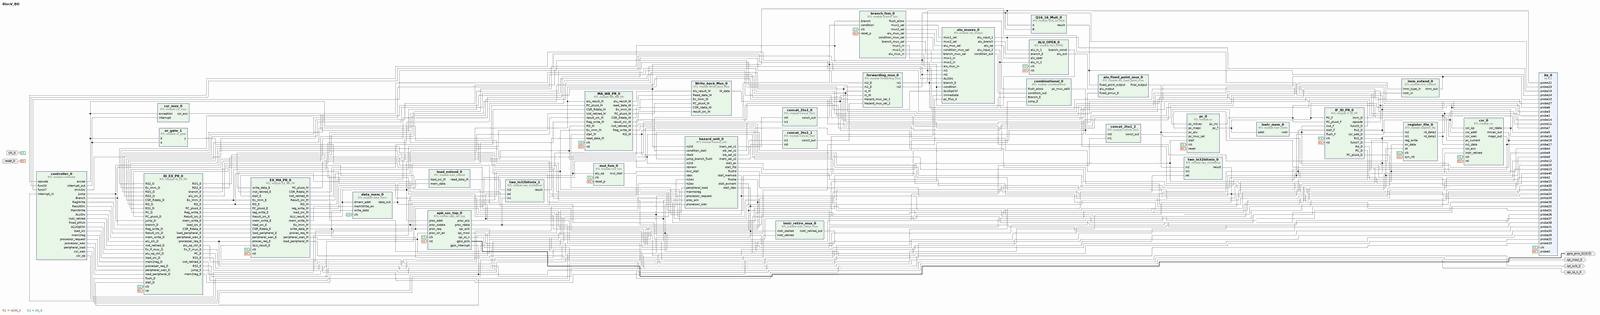
[diagram p0: block diagram of the top level, whole]
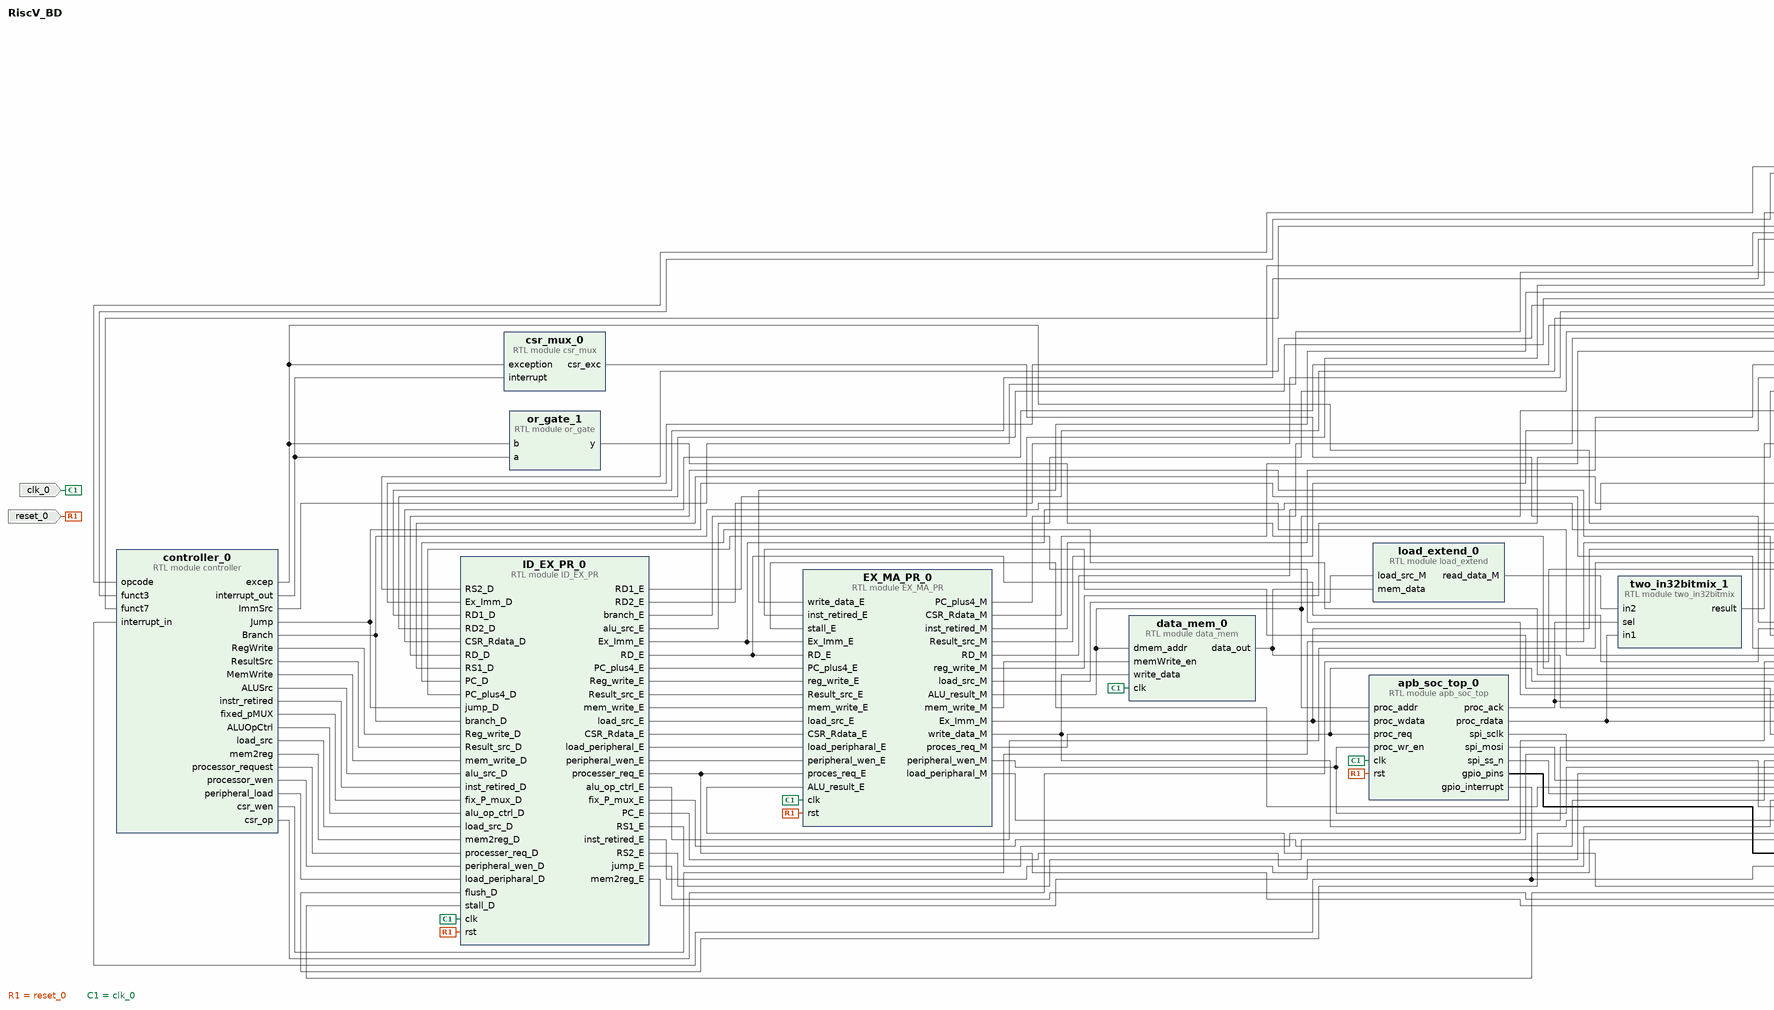
[diagram p1: block diagram of the top level, left part]
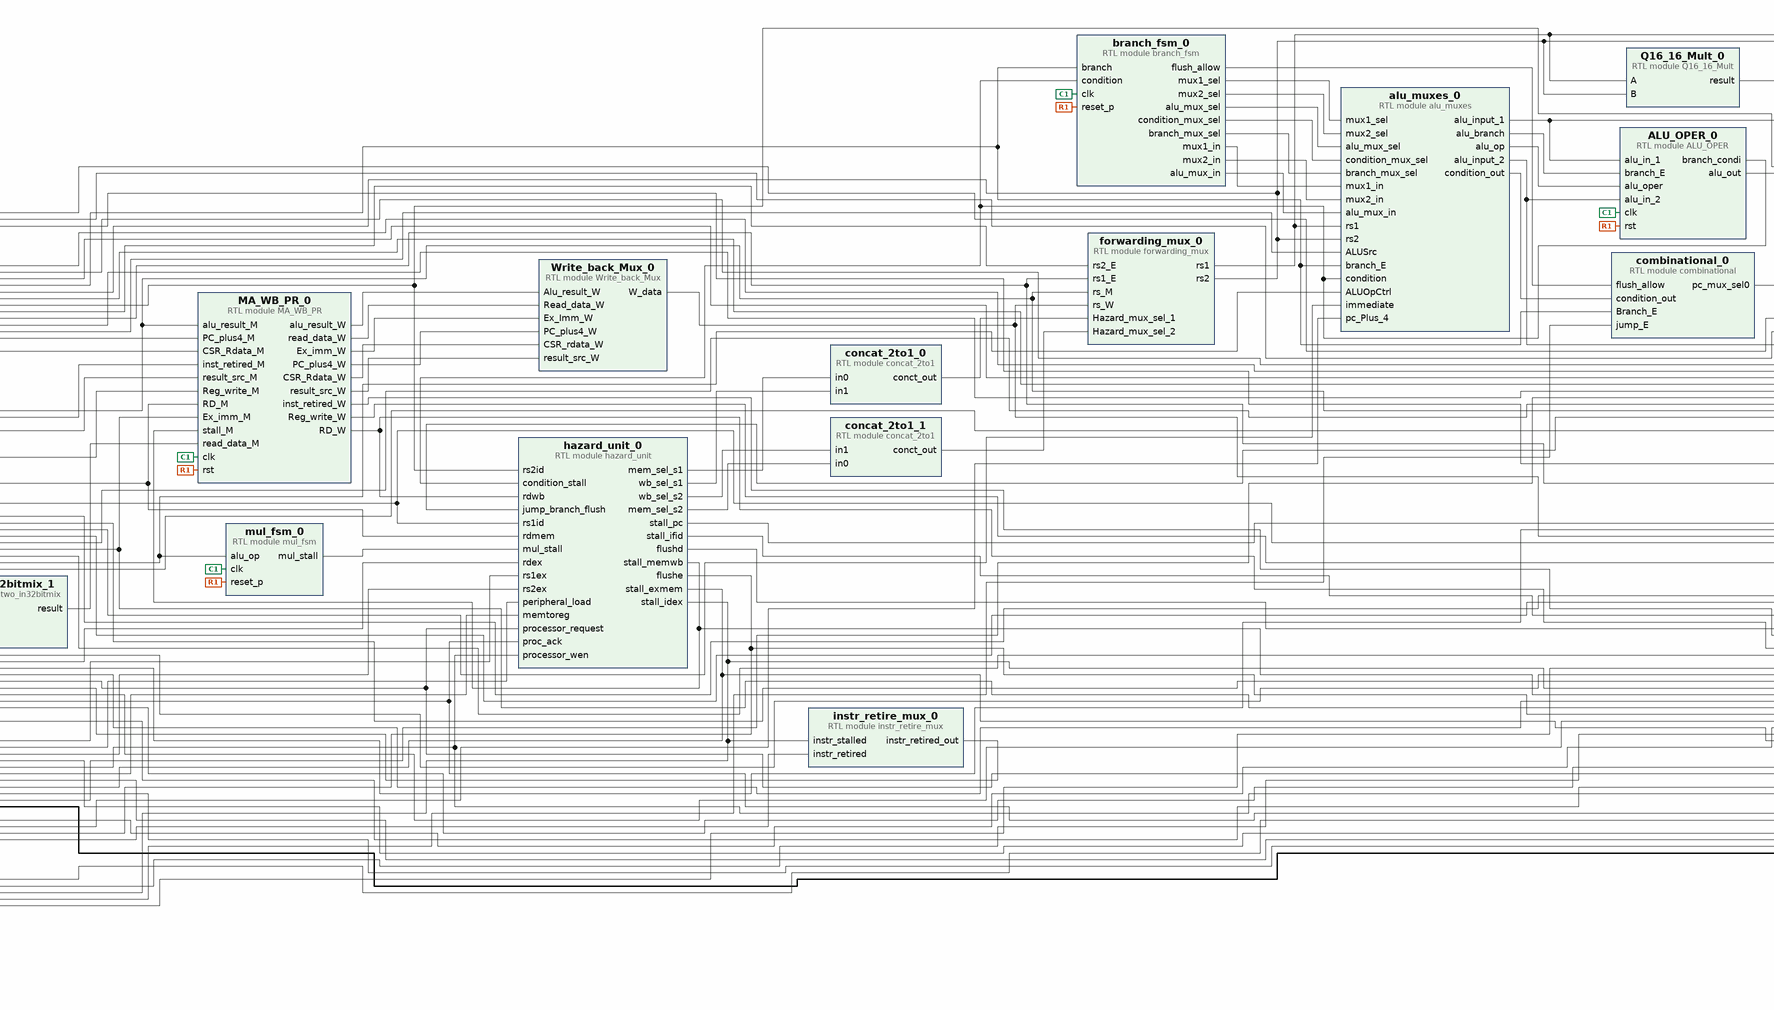
[diagram p2: block diagram of the top level, centre part]
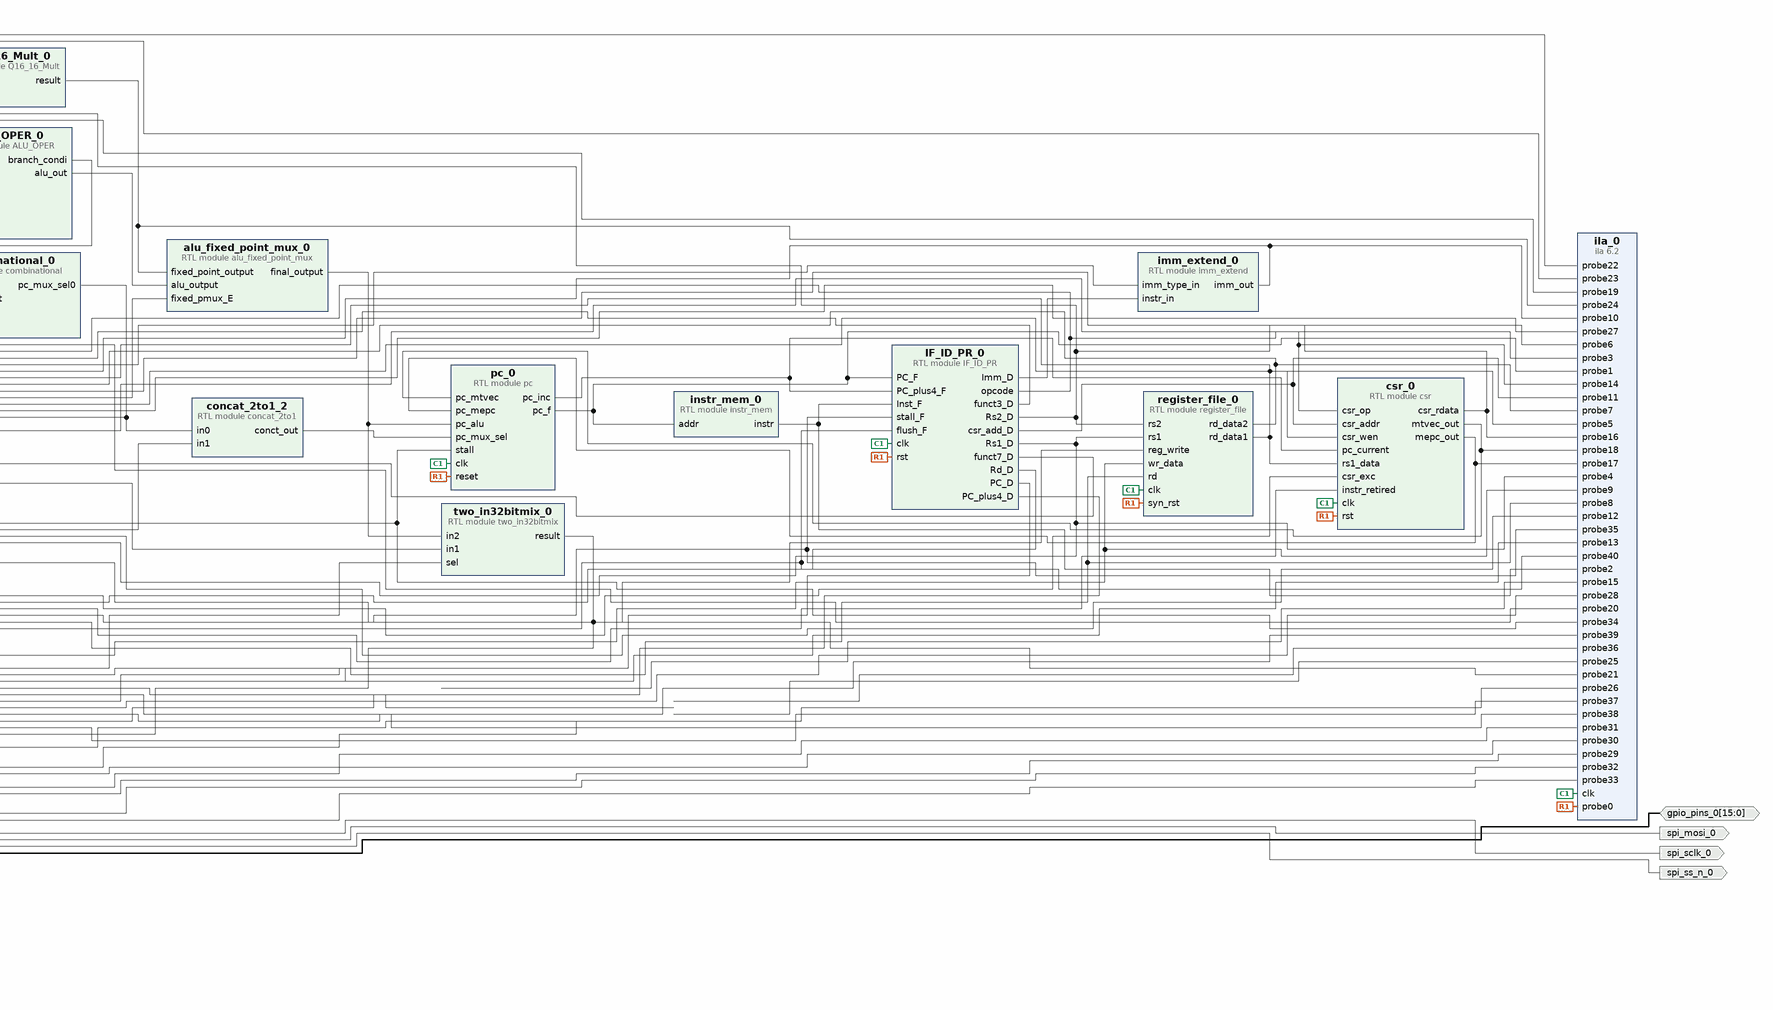
[diagram p3: block diagram of the top level, right part]
# Vivado block design RiscV_BD, xc7z020clg400-1, Vivado 2020.2
create_bd_design RiscV_BD

create_bd_port -dir I -type rst reset_0
create_bd_port -dir I -type clk clk_0
create_bd_port -dir O spi_sclk_0
create_bd_port -dir O spi_mosi_0
create_bd_port -dir O spi_ss_n_0
create_bd_port -dir IO -from 15 -to 0 gpio_pins_0

create_bd_cell -type module -reference register_file register_file_0
create_bd_cell -type module -reference csr csr_0
create_bd_cell -type module -reference alu_fixed_point_mux alu_fixed_point_mux_0
create_bd_cell -type module -reference csr_mux csr_mux_0
create_bd_cell -type module -reference forwarding_mux forwarding_mux_0
create_bd_cell -type module -reference load_extend load_extend_0
create_bd_cell -type module -reference Write_back_Mux Write_back_Mux_0
create_bd_cell -type module -reference combinational combinational_0
create_bd_cell -type module -reference instr_retire_mux instr_retire_mux_0
create_bd_cell -type module -reference concat_2to1 concat_2to1_0
create_bd_cell -type module -reference concat_2to1 concat_2to1_1
create_bd_cell -type module -reference concat_2to1 concat_2to1_2
create_bd_cell -type module -reference or_gate or_gate_1
create_bd_cell -type module -reference alu_muxes alu_muxes_0
create_bd_cell -type module -reference pc pc_0
create_bd_cell -type module -reference mul_fsm mul_fsm_0
create_bd_cell -type module -reference IF_ID_PR IF_ID_PR_0
create_bd_cell -type module -reference MA_WB_PR MA_WB_PR_0
create_bd_cell -type module -reference imm_extend imm_extend_0
create_bd_cell -type module -reference hazard_unit hazard_unit_0
create_bd_cell -type module -reference two_in32bitmix two_in32bitmix_0
create_bd_cell -type module -reference two_in32bitmix two_in32bitmix_1
create_bd_cell -type module -reference ID_EX_PR ID_EX_PR_0
create_bd_cell -type module -reference EX_MA_PR EX_MA_PR_0
create_bd_cell -type ip -vlnv xilinx.com:ip:ila:6.2 ila_0
set_property -dict [list \
  CONFIG.C_ENABLE_ILA_AXI_MON false \
  CONFIG.C_MONITOR_TYPE Native \
  CONFIG.C_NUM_OF_PROBES 41 \
  CONFIG.C_PROBE10_WIDTH 32 \
  CONFIG.C_PROBE11_WIDTH 12 \
  CONFIG.C_PROBE12_WIDTH 1 \
  CONFIG.C_PROBE14_WIDTH 2 \
  CONFIG.C_PROBE15_WIDTH 1 \
  CONFIG.C_PROBE16_WIDTH 32 \
  CONFIG.C_PROBE17_WIDTH 32 \
  CONFIG.C_PROBE18_WIDTH 32 \
  CONFIG.C_PROBE19_WIDTH 32 \
  CONFIG.C_PROBE1_WIDTH 32 \
  CONFIG.C_PROBE20_WIDTH 32 \
  CONFIG.C_PROBE21_WIDTH 32 \
  CONFIG.C_PROBE22_WIDTH 32 \
  CONFIG.C_PROBE23_WIDTH 32 \
  CONFIG.C_PROBE24_WIDTH 32 \
  CONFIG.C_PROBE25_WIDTH 32 \
  CONFIG.C_PROBE26_WIDTH 32 \
  CONFIG.C_PROBE27_WIDTH 32 \
  CONFIG.C_PROBE28_WIDTH 32 \
  CONFIG.C_PROBE2_WIDTH 32 \
  CONFIG.C_PROBE31_WIDTH 32 \
  CONFIG.C_PROBE34_WIDTH 1 \
  CONFIG.C_PROBE3_WIDTH 7 \
  CONFIG.C_PROBE4_WIDTH 5 \
  CONFIG.C_PROBE5_WIDTH 32 \
  CONFIG.C_PROBE6_WIDTH 5 \
  CONFIG.C_PROBE7_WIDTH 32 \
  CONFIG.C_PROBE8_WIDTH 5 \
  CONFIG.C_PROBE9_WIDTH 32 \
] [get_bd_cells ila_0]
create_bd_cell -type module -reference apb_soc_top apb_soc_top_0
create_bd_cell -type module -reference Q16_16_Mult Q16_16_Mult_0
create_bd_cell -type module -reference ALU_OPER ALU_OPER_0
create_bd_cell -type module -reference branch_fsm branch_fsm_0
create_bd_cell -type module -reference controller controller_0
create_bd_cell -type module -reference instr_mem instr_mem_0
create_bd_cell -type module -reference data_mem data_mem_0

# ---- connections ----

connect_bd_net [get_bd_pins IF_ID_PR_0/Rs2_D] \
  [get_bd_pins register_file_0/rs2] [get_bd_pins hazard_unit_0/rs2id] [get_bd_pins ID_EX_PR_0/RS2_D] \
  [get_bd_pins ila_0/probe6]
connect_bd_net [get_bd_pins IF_ID_PR_0/opcode] [get_bd_pins ila_0/probe3] [get_bd_pins controller_0/opcode]
connect_bd_net [get_bd_pins IF_ID_PR_0/funct3_D] [get_bd_pins controller_0/funct3]
connect_bd_net [get_bd_pins IF_ID_PR_0/funct7_D] [get_bd_pins controller_0/funct7]
connect_bd_net [get_bd_pins IF_ID_PR_0/Imm_D] [get_bd_pins imm_extend_0/instr_in]
connect_bd_net [get_bd_pins controller_0/ImmSrc] [get_bd_pins imm_extend_0/imm_type_in]
connect_bd_net [get_bd_pins imm_extend_0/imm_out] [get_bd_pins ID_EX_PR_0/Ex_Imm_D] [get_bd_pins ila_0/probe10]
connect_bd_net [get_bd_pins IF_ID_PR_0/csr_add_D] [get_bd_pins csr_0/csr_addr] [get_bd_pins ila_0/probe11]
connect_bd_net [get_bd_pins register_file_0/rd_data1] [get_bd_pins csr_0/rs1_data] [get_bd_pins ID_EX_PR_0/RD1_D] [get_bd_pins ila_0/probe5]
connect_bd_net [get_bd_pins register_file_0/rd_data2] [get_bd_pins ID_EX_PR_0/RD2_D] [get_bd_pins ila_0/probe7]
connect_bd_net [get_bd_pins csr_0/csr_rdata] [get_bd_pins ID_EX_PR_0/CSR_Rdata_D] [get_bd_pins ila_0/probe16]
connect_bd_net [get_bd_pins controller_0/csr_wen] [get_bd_pins csr_0/csr_wen]
connect_bd_net [get_bd_pins controller_0/csr_op] [get_bd_pins csr_0/csr_op] [get_bd_pins ila_0/probe14]
connect_bd_net [get_bd_pins ID_EX_PR_0/RD1_E] [get_bd_pins forwarding_mux_0/rs1_E] [get_bd_pins two_in32bitmix_0/in1]
connect_bd_net [get_bd_pins ID_EX_PR_0/RD2_E] [get_bd_pins forwarding_mux_0/rs2_E]
connect_bd_net [get_bd_pins forwarding_mux_0/rs1] [get_bd_pins alu_muxes_0/rs1] [get_bd_pins ila_0/probe22] [get_bd_pins Q16_16_Mult_0/A]
connect_bd_net [get_bd_pins forwarding_mux_0/rs2] \
  [get_bd_pins alu_muxes_0/rs2] [get_bd_pins EX_MA_PR_0/write_data_E] [get_bd_pins ila_0/probe23] \
  [get_bd_pins Q16_16_Mult_0/B]
connect_bd_net [get_bd_pins branch_fsm_0/mux1_sel] [get_bd_pins alu_muxes_0/mux1_sel]
connect_bd_net [get_bd_pins branch_fsm_0/mux2_sel] [get_bd_pins alu_muxes_0/mux2_sel]
connect_bd_net [get_bd_pins branch_fsm_0/alu_mux_sel] [get_bd_pins alu_muxes_0/alu_mux_sel]
connect_bd_net [get_bd_pins branch_fsm_0/condition_mux_sel] [get_bd_pins alu_muxes_0/condition_mux_sel]
connect_bd_net [get_bd_pins branch_fsm_0/branch_mux_sel] [get_bd_pins alu_muxes_0/branch_mux_sel]
connect_bd_net [get_bd_pins branch_fsm_0/mux1_in] [get_bd_pins alu_muxes_0/mux1_in]
connect_bd_net [get_bd_pins branch_fsm_0/mux2_in] [get_bd_pins alu_muxes_0/mux2_in]
connect_bd_net [get_bd_pins branch_fsm_0/alu_mux_in] [get_bd_pins alu_muxes_0/alu_mux_in]
connect_bd_net [get_bd_pins ALU_OPER_0/branch_condi] \
  [get_bd_pins alu_muxes_0/condition] [get_bd_pins hazard_unit_0/condition_stall] [get_bd_pins branch_fsm_0/condition]
connect_bd_net [get_bd_pins alu_muxes_0/alu_branch] [get_bd_pins ALU_OPER_0/branch_E]
connect_bd_net [get_bd_pins alu_muxes_0/alu_input_1] [get_bd_pins ila_0/probe19] [get_bd_pins ALU_OPER_0/alu_in_1]
connect_bd_net [get_bd_pins alu_muxes_0/alu_op] [get_bd_pins ALU_OPER_0/alu_oper]
connect_bd_net [get_bd_pins ID_EX_PR_0/branch_E] \
  [get_bd_pins combinational_0/Branch_E] [get_bd_pins alu_muxes_0/branch_E] [get_bd_pins branch_fsm_0/branch]
connect_bd_net [get_bd_pins ID_EX_PR_0/alu_src_E] [get_bd_pins alu_muxes_0/ALUSrc]
connect_bd_net [get_bd_pins ID_EX_PR_0/alu_op_ctrl_E] [get_bd_pins alu_muxes_0/ALUOpCtrl] [get_bd_pins mul_fsm_0/alu_op]
connect_bd_net [get_bd_pins ID_EX_PR_0/PC_plus4_E] [get_bd_pins EX_MA_PR_0/PC_plus4_E]
connect_bd_net [get_bd_pins ID_EX_PR_0/Ex_Imm_E] [get_bd_pins alu_muxes_0/immediate] [get_bd_pins EX_MA_PR_0/Ex_Imm_E]
connect_bd_net [get_bd_pins ALU_OPER_0/alu_out] [get_bd_pins alu_fixed_point_mux_0/alu_output]
connect_bd_net [get_bd_pins Q16_16_Mult_0/result] [get_bd_pins alu_fixed_point_mux_0/fixed_point_output] [get_bd_pins ila_0/probe24]
connect_bd_net [get_bd_pins alu_fixed_point_mux_0/final_output] [get_bd_pins pc_0/pc_alu] [get_bd_pins two_in32bitmix_0/in2]
connect_bd_net [get_bd_pins ID_EX_PR_0/fix_P_mux_E] [get_bd_pins alu_fixed_point_mux_0/fixed_pmux_E]
connect_bd_net [get_bd_pins EX_MA_PR_0/ALU_result_M] \
  [get_bd_pins forwarding_mux_0/rs_M] [get_bd_pins MA_WB_PR_0/alu_result_M] [get_bd_pins ila_0/probe27] \
  [get_bd_pins apb_soc_top_0/proc_addr] [get_bd_pins data_mem_0/dmem_addr]
connect_bd_net [get_bd_pins csr_mux_0/csr_exc] [get_bd_pins csr_0/csr_exc]
connect_bd_net [get_bd_pins IF_ID_PR_0/Rd_D] [get_bd_pins ID_EX_PR_0/RD_D]
connect_bd_net [get_bd_pins controller_0/RegWrite] [get_bd_pins ID_EX_PR_0/Reg_write_D]
connect_bd_net [get_bd_pins controller_0/ResultSrc] [get_bd_pins ID_EX_PR_0/Result_src_D]
connect_bd_net [get_bd_pins controller_0/MemWrite] [get_bd_pins ID_EX_PR_0/mem_write_D]
connect_bd_net [get_bd_pins controller_0/Jump] [get_bd_pins ID_EX_PR_0/jump_D] [get_bd_pins ila_0/probe12]
connect_bd_net [get_bd_pins controller_0/Branch] [get_bd_pins ID_EX_PR_0/branch_D] [get_bd_pins ila_0/probe13]
connect_bd_net [get_bd_pins controller_0/ALUSrc] [get_bd_pins ID_EX_PR_0/alu_src_D]
connect_bd_net [get_bd_pins controller_0/instr_retired] [get_bd_pins ID_EX_PR_0/inst_retired_D]
connect_bd_net [get_bd_pins controller_0/fixed_pMUX] [get_bd_pins ID_EX_PR_0/fix_P_mux_D]
connect_bd_net [get_bd_pins controller_0/excep] [get_bd_pins csr_mux_0/exception] [get_bd_pins or_gate_1/b] [get_bd_pins ila_0/probe15]
connect_bd_net [get_bd_pins IF_ID_PR_0/Rs1_D] \
  [get_bd_pins register_file_0/rs1] [get_bd_pins hazard_unit_0/rs1id] [get_bd_pins ID_EX_PR_0/RS1_D] \
  [get_bd_pins ila_0/probe4]
connect_bd_net [get_bd_pins IF_ID_PR_0/PC_D] [get_bd_pins ID_EX_PR_0/PC_D]
connect_bd_net [get_bd_pins IF_ID_PR_0/PC_plus4_D] [get_bd_pins ID_EX_PR_0/PC_plus4_D]
connect_bd_net [get_bd_pins ID_EX_PR_0/Reg_write_E] [get_bd_pins EX_MA_PR_0/reg_write_E]
connect_bd_net [get_bd_pins ID_EX_PR_0/Result_src_E] [get_bd_pins EX_MA_PR_0/Result_src_E]
connect_bd_net [get_bd_pins ID_EX_PR_0/mem_write_E] [get_bd_pins EX_MA_PR_0/mem_write_E]
connect_bd_net [get_bd_pins ID_EX_PR_0/load_src_E] [get_bd_pins EX_MA_PR_0/load_src_E]
connect_bd_net [get_bd_pins ID_EX_PR_0/RD_E] [get_bd_pins hazard_unit_0/rdex] [get_bd_pins EX_MA_PR_0/RD_E]
connect_bd_net [get_bd_pins ID_EX_PR_0/CSR_Rdata_E] [get_bd_pins EX_MA_PR_0/CSR_Rdata_E]
connect_bd_net [get_bd_pins EX_MA_PR_0/PC_plus4_M] [get_bd_pins MA_WB_PR_0/PC_plus4_M]
connect_bd_net [get_bd_pins EX_MA_PR_0/CSR_Rdata_M] [get_bd_pins MA_WB_PR_0/CSR_Rdata_M]
connect_bd_net [get_bd_pins EX_MA_PR_0/Ex_Imm_M] [get_bd_pins MA_WB_PR_0/Ex_imm_M] [get_bd_pins ila_0/probe28] [get_bd_pins apb_soc_top_0/proc_wdata]
connect_bd_net [get_bd_pins EX_MA_PR_0/RD_M] [get_bd_pins MA_WB_PR_0/RD_M] [get_bd_pins hazard_unit_0/rdmem]
connect_bd_net [get_bd_pins EX_MA_PR_0/load_src_M] [get_bd_pins load_extend_0/load_src_M]
connect_bd_net [get_bd_pins EX_MA_PR_0/inst_retired_M] [get_bd_pins MA_WB_PR_0/inst_retired_M]
connect_bd_net [get_bd_pins EX_MA_PR_0/Result_src_M] [get_bd_pins MA_WB_PR_0/result_src_M]
connect_bd_net [get_bd_pins EX_MA_PR_0/reg_write_M] [get_bd_pins MA_WB_PR_0/Reg_write_M]
connect_bd_net [get_bd_pins MA_WB_PR_0/alu_result_W] [get_bd_pins Write_back_Mux_0/Alu_result_W]
connect_bd_net [get_bd_pins MA_WB_PR_0/read_data_W] [get_bd_pins Write_back_Mux_0/Read_data_W]
connect_bd_net [get_bd_pins MA_WB_PR_0/Ex_imm_W] [get_bd_pins Write_back_Mux_0/Ex_Imm_W]
connect_bd_net [get_bd_pins MA_WB_PR_0/PC_plus4_W] [get_bd_pins Write_back_Mux_0/PC_plus4_W]
connect_bd_net [get_bd_pins MA_WB_PR_0/CSR_Rdata_W] [get_bd_pins Write_back_Mux_0/CSR_rdata_W]
connect_bd_net [get_bd_pins MA_WB_PR_0/result_src_W] [get_bd_pins Write_back_Mux_0/result_src_W]
connect_bd_net [get_bd_pins MA_WB_PR_0/inst_retired_W] [get_bd_pins csr_0/instr_retired]
connect_bd_net [get_bd_pins MA_WB_PR_0/Reg_write_W] [get_bd_pins register_file_0/reg_write]
connect_bd_net [get_bd_pins csr_0/mtvec_out] [get_bd_pins pc_0/pc_mtvec] [get_bd_pins ila_0/probe18]
connect_bd_net [get_bd_pins pc_0/pc_f] [get_bd_pins IF_ID_PR_0/PC_F] [get_bd_pins ila_0/probe1] [get_bd_pins instr_mem_0/addr]
connect_bd_net [get_bd_pins pc_0/pc_inc] [get_bd_pins csr_0/pc_current] [get_bd_pins IF_ID_PR_0/PC_plus4_F]
connect_bd_net [get_bd_pins alu_muxes_0/alu_input_2] [get_bd_pins ila_0/probe20] [get_bd_pins ALU_OPER_0/alu_in_2]
connect_bd_net [get_bd_pins ID_EX_PR_0/PC_E] [get_bd_pins alu_muxes_0/pc_Plus_4]
connect_bd_net [get_bd_pins ID_EX_PR_0/inst_retired_E] [get_bd_pins instr_retire_mux_0/instr_retired]
connect_bd_net [get_bd_pins instr_retire_mux_0/instr_retired_out] [get_bd_pins EX_MA_PR_0/inst_retired_E]
connect_bd_net [get_bd_pins branch_fsm_0/flush_allow] [get_bd_pins combinational_0/flush_allow]
connect_bd_net [get_bd_pins ID_EX_PR_0/jump_E] [get_bd_pins combinational_0/jump_E]
connect_bd_net [get_bd_pins alu_muxes_0/condition_out] [get_bd_pins combinational_0/condition_out]
connect_bd_net [get_bd_pins Write_back_Mux_0/W_data] \
  [get_bd_pins register_file_0/wr_data] [get_bd_pins forwarding_mux_0/rs_W] [get_bd_pins ila_0/probe9]
connect_bd_net [get_bd_pins MA_WB_PR_0/RD_W] [get_bd_pins register_file_0/rd] [get_bd_pins hazard_unit_0/rdwb] [get_bd_pins ila_0/probe8]
connect_bd_net [get_bd_pins mul_fsm_0/mul_stall] [get_bd_pins hazard_unit_0/mul_stall]
connect_bd_net [get_bd_pins ID_EX_PR_0/RS1_E] [get_bd_pins hazard_unit_0/rs1ex]
connect_bd_net [get_bd_pins ID_EX_PR_0/RS2_E] [get_bd_pins hazard_unit_0/rs2ex]
connect_bd_net [get_bd_pins combinational_0/pc_mux_sel0] [get_bd_pins concat_2to1_2/in0] [get_bd_pins hazard_unit_0/jump_branch_flush]
connect_bd_net [get_bd_pins hazard_unit_0/stall_ifid] [get_bd_pins IF_ID_PR_0/stall_F] [get_bd_pins ila_0/probe35]
connect_bd_net [get_bd_pins csr_0/mepc_out] [get_bd_pins pc_0/pc_mepc] [get_bd_pins ila_0/probe17]
connect_bd_net [get_bd_pins hazard_unit_0/mem_sel_s1] [get_bd_pins concat_2to1_0/in0]
connect_bd_net [get_bd_pins hazard_unit_0/wb_sel_s2] [get_bd_pins concat_2to1_1/in1]
connect_bd_net [get_bd_pins hazard_unit_0/wb_sel_s1] [get_bd_pins concat_2to1_0/in1]
connect_bd_net [get_bd_pins hazard_unit_0/mem_sel_s2] [get_bd_pins concat_2to1_1/in0]
connect_bd_net [get_bd_pins concat_2to1_0/conct_out] [get_bd_pins forwarding_mux_0/Hazard_mux_sel_1]
connect_bd_net [get_bd_pins concat_2to1_1/conct_out] [get_bd_pins forwarding_mux_0/Hazard_mux_sel_2]
connect_bd_net [get_bd_pins hazard_unit_0/stall_pc] [get_bd_pins pc_0/stall] [get_bd_pins ila_0/probe34]
connect_bd_net [get_bd_pins hazard_unit_0/flushd] [get_bd_pins IF_ID_PR_0/flush_F] [get_bd_pins ila_0/probe40]
connect_bd_net [get_bd_pins hazard_unit_0/flushe] [get_bd_pins ID_EX_PR_0/flush_D] [get_bd_pins ila_0/probe39]
connect_bd_net [get_bd_pins hazard_unit_0/stall_idex] \
  [get_bd_pins instr_retire_mux_0/instr_stalled] [get_bd_pins ID_EX_PR_0/stall_D] [get_bd_pins ila_0/probe36]
connect_bd_net [get_bd_pins concat_2to1_2/conct_out] [get_bd_pins pc_0/pc_mux_sel]
connect_bd_net -net interrupt_0_1 [get_bd_pins controller_0/interrupt_out] [get_bd_pins csr_mux_0/interrupt] [get_bd_pins or_gate_1/a]
connect_bd_net -net reset_0_1 [get_bd_ports reset_0] \
  [get_bd_pins register_file_0/syn_rst] [get_bd_pins csr_0/rst] [get_bd_pins pc_0/reset] [get_bd_pins mul_fsm_0/reset_p] \
  [get_bd_pins IF_ID_PR_0/rst] [get_bd_pins MA_WB_PR_0/rst] [get_bd_pins ID_EX_PR_0/rst] [get_bd_pins EX_MA_PR_0/rst] \
  [get_bd_pins ila_0/probe0] [get_bd_pins apb_soc_top_0/rst] [get_bd_pins ALU_OPER_0/rst] [get_bd_pins branch_fsm_0/reset_p]
connect_bd_net -net clk_0_1 [get_bd_ports clk_0] \
  [get_bd_pins csr_0/clk] [get_bd_pins register_file_0/clk] [get_bd_pins pc_0/clk] [get_bd_pins mul_fsm_0/clk] \
  [get_bd_pins IF_ID_PR_0/clk] [get_bd_pins MA_WB_PR_0/clk] [get_bd_pins ID_EX_PR_0/clk] [get_bd_pins EX_MA_PR_0/clk] \
  [get_bd_pins ila_0/clk] [get_bd_pins apb_soc_top_0/clk] [get_bd_pins ALU_OPER_0/clk] [get_bd_pins branch_fsm_0/clk] \
  [get_bd_pins data_mem_0/clk]
connect_bd_net [get_bd_pins or_gate_1/y] [get_bd_pins concat_2to1_2/in1]
connect_bd_net [get_bd_pins instr_mem_0/instr] [get_bd_pins IF_ID_PR_0/Inst_F] [get_bd_pins ila_0/probe2]
connect_bd_net [get_bd_pins EX_MA_PR_0/mem_write_M] [get_bd_pins data_mem_0/memWrite_en]
connect_bd_net [get_bd_pins EX_MA_PR_0/write_data_M] [get_bd_pins ila_0/probe25] [get_bd_pins data_mem_0/write_data]
connect_bd_net [get_bd_pins data_mem_0/data_out] [get_bd_pins load_extend_0/mem_data] [get_bd_pins ila_0/probe26]
connect_bd_net [get_bd_pins controller_0/ALUOpCtrl] [get_bd_pins ID_EX_PR_0/alu_op_ctrl_D]
connect_bd_net [get_bd_pins controller_0/load_src] [get_bd_pins ID_EX_PR_0/load_src_D]
connect_bd_net [get_bd_pins controller_0/mem2reg] [get_bd_pins ID_EX_PR_0/mem2reg_D]
connect_bd_net [get_bd_pins ID_EX_PR_0/mem2reg_E] [get_bd_pins hazard_unit_0/memtoreg]
connect_bd_net [get_bd_pins hazard_unit_0/stall_exmem] [get_bd_pins EX_MA_PR_0/stall_E] [get_bd_pins ila_0/probe37]
connect_bd_net [get_bd_pins hazard_unit_0/stall_memwb] [get_bd_pins MA_WB_PR_0/stall_M] [get_bd_pins ila_0/probe38]
connect_bd_net [get_bd_pins controller_0/processor_request] [get_bd_pins ID_EX_PR_0/processer_req_D]
connect_bd_net [get_bd_pins controller_0/processor_wen] [get_bd_pins ID_EX_PR_0/peripheral_wen_D]
connect_bd_net [get_bd_pins controller_0/peripheral_load] [get_bd_pins ID_EX_PR_0/load_peripharal_D]
connect_bd_net [get_bd_pins ID_EX_PR_0/processer_req_E] [get_bd_pins two_in32bitmix_0/sel] [get_bd_pins EX_MA_PR_0/proces_req_E]
connect_bd_net [get_bd_pins ID_EX_PR_0/load_peripheral_E] [get_bd_pins EX_MA_PR_0/load_peripharal_E]
connect_bd_net [get_bd_pins ID_EX_PR_0/peripheral_wen_E] [get_bd_pins EX_MA_PR_0/peripheral_wen_E]
connect_bd_net -net two_in32bitmix_0_out [get_bd_pins two_in32bitmix_0/result] [get_bd_pins EX_MA_PR_0/ALU_result_E] [get_bd_pins ila_0/probe21]
connect_bd_net [get_bd_pins load_extend_0/read_data_M] [get_bd_pins two_in32bitmix_1/in2]
connect_bd_net [get_bd_pins apb_soc_top_0/proc_rdata] [get_bd_pins two_in32bitmix_1/in1] [get_bd_pins ila_0/probe31]
connect_bd_net [get_bd_pins EX_MA_PR_0/proces_req_M] \
  [get_bd_pins hazard_unit_0/processor_request] [get_bd_pins ila_0/probe30] [get_bd_pins apb_soc_top_0/proc_req]
connect_bd_net [get_bd_pins EX_MA_PR_0/peripheral_wen_M] \
  [get_bd_pins hazard_unit_0/processor_wen] [get_bd_pins ila_0/probe29] [get_bd_pins apb_soc_top_0/proc_wr_en]
connect_bd_net [get_bd_pins apb_soc_top_0/proc_ack] \
  [get_bd_pins hazard_unit_0/proc_ack] [get_bd_pins two_in32bitmix_1/sel] [get_bd_pins ila_0/probe32]
connect_bd_net [get_bd_pins EX_MA_PR_0/load_peripharal_M] [get_bd_pins hazard_unit_0/peripheral_load]
connect_bd_net [get_bd_pins apb_soc_top_0/gpio_interrupt] [get_bd_pins ila_0/probe33] [get_bd_pins controller_0/interrupt_in]
connect_bd_net [get_bd_pins two_in32bitmix_1/result] [get_bd_pins MA_WB_PR_0/read_data_M]
connect_bd_net [get_bd_pins apb_soc_top_0/spi_sclk] [get_bd_ports spi_sclk_0]
connect_bd_net [get_bd_pins apb_soc_top_0/spi_mosi] [get_bd_ports spi_mosi_0]
connect_bd_net [get_bd_pins apb_soc_top_0/spi_ss_n] [get_bd_ports spi_ss_n_0]
connect_bd_net [get_bd_ports gpio_pins_0] [get_bd_pins apb_soc_top_0/gpio_pins]

validate_bd_design
save_bd_design
